# EAGLE design AOC v1 (EAGLE 7.7.0)
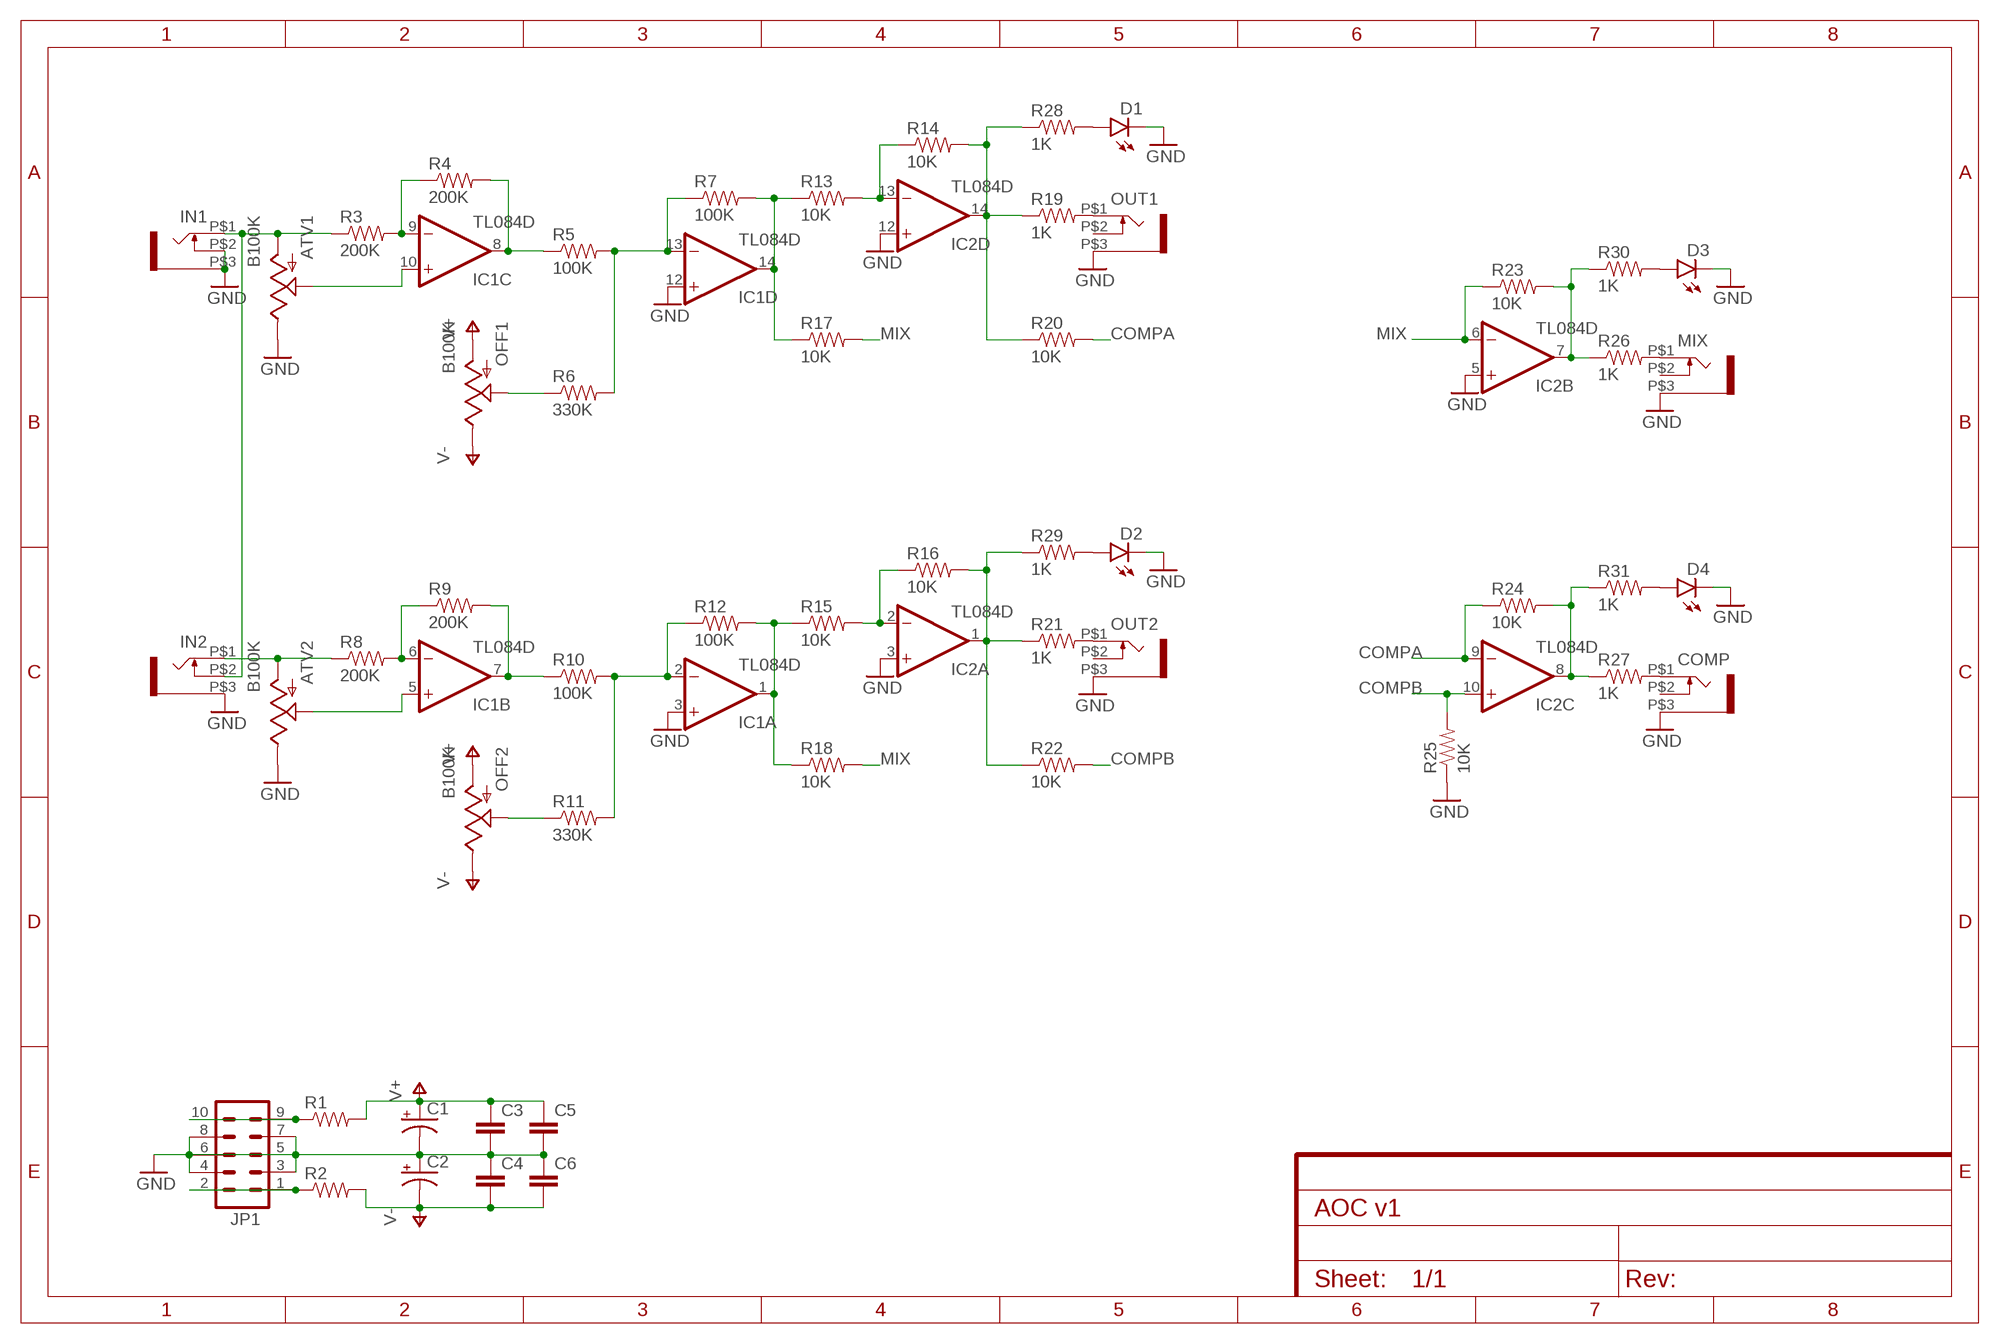
[diagram p0: schematic, sheet 1]

## Parts
ATV1  B100K  POT  [ALPS_POT]
ATV2  B100K  POT  [ALPS_POT]
C1  CAP_POLPTH2  [CPOL-RADIAL-10UF-25V]
C2  CAP_POLPTH2  [CPOL-RADIAL-10UF-25V]
C3  CAP0805  [0805]
C4  CAP0805  [0805]
C5  CAP0805  [0805]
C6  CAP0805  [0805]
COMP  WQP-PJ301M-12_JACK  [WQP-PJ301M-12_JACK]
D1  LED3MM  [LED3MM]
D2  LED3MM  [LED3MM]
D3  LED3MM  [LED3MM]
D4  LED3MM  [LED3MM]
IC1  TL084D  [SO14]
IC2  TL084D  [SO14]
IN1  WQP-PJ301M-12_JACK  [WQP-PJ301M-12_JACK]
IN2  WQP-PJ301M-12_JACK  [WQP-PJ301M-12_JACK]
JP1  M05X2PTH  [AVR_ICSP]
MIX  WQP-PJ301M-12_JACK  [WQP-PJ301M-12_JACK]
OFF1  B100K  POT  [ALPS_POT]
OFF2  B100K  POT  [ALPS_POT]
OUT1  WQP-PJ301M-12_JACK  [WQP-PJ301M-12_JACK]
OUT2  WQP-PJ301M-12_JACK  [WQP-PJ301M-12_JACK]
R1  RESISTOR0805-RES  [0805@1]
R2  RESISTOR0805-RES  [0805@1]
R3  200K  RESISTOR0805-RES  [0805@1]
R4  200K  RESISTOR0805-RES  [0805@1]
R5  100K  RESISTOR0805-RES  [0805@1]
R6  330K  RESISTOR0805-RES  [0805@1]
R7  100K  RESISTOR0805-RES  [0805@1]
R8  200K  RESISTOR0805-RES  [0805@1]
R9  200K  RESISTOR0805-RES  [0805@1]
R10  100K  RESISTOR0805-RES  [0805@1]
R11  330K  RESISTOR0805-RES  [0805@1]
R12  100K  RESISTOR0805-RES  [0805@1]
R13  10K  RESISTOR0805-RES  [0805@1]
R14  10K  RESISTOR0805-RES  [0805@1]
R15  10K  RESISTOR0805-RES  [0805@1]
R16  10K  RESISTOR0805-RES  [0805@1]
R17  10K  RESISTOR0805-RES  [0805@1]
R18  10K  RESISTOR0805-RES  [0805@1]
R19  1K  RESISTOR0805-RES  [0805@1]
R20  10K  RESISTOR0805-RES  [0805@1]
R21  1K  RESISTOR0805-RES  [0805@1]
R22  10K  RESISTOR0805-RES  [0805@1]
R23  10K  RESISTOR0805-RES  [0805@1]
R24  10K  RESISTOR0805-RES  [0805@1]
R25  10K  RESISTOR0805-RES  [0805@1]
R26  1K  RESISTOR0805-RES  [0805@1]
R27  1K  RESISTOR0805-RES  [0805@1]
R28  1K  RESISTOR0805-RES  [0805@1]
R29  1K  RESISTOR0805-RES  [0805@1]
R30  1K  RESISTOR0805-RES  [0805@1]
R31  1K  RESISTOR0805-RES  [0805@1]

## Nets
COMPA: IC2.9(C:-IN) R20.2 R24.1
COMPB: IC2.10(C:+IN) R22.2 R25.2
GND: ATV1.P$1(E) ATV2.P$1(E) C1.2(-) C2.1(+) C3.2 C4.1 C5.2 C6.1 COMP.P$3 D1.K(C) D2.K(C) D3.K(C) D4.K(C) IC1.3(A:+IN) IC1.12(D:+IN) IC2.3(A:+IN) IC2.5(B:+IN) IC2.12(D:+IN) IN1.P$2 IN1.P$3 IN2.P$3 JP1.3 JP1.4 JP1.5 JP1.6 JP1.7 JP1.8 MIX.P$3 OUT1.P$3 OUT2.P$3 R25.1
MIX: IC2.6(B:-IN) R17.2 R18.2 R23.1
N$1: JP1.9 JP1.10 R1.1
N$2: JP1.1 JP1.2 R2.1
N$3: IC1.9(C:-IN) R3.2 R4.1
N$4: ATV1.P$3(A) IN1.P$1 IN2.P$2 R3.1
N$5: IC1.8(C:OUT) R4.2 R5.1
N$6: ATV1.P$2(S) IC1.10(C:+IN)
N$7: OFF1.P$2(S) R6.1
N$8: IC1.13(D:-IN) R5.2 R6.2 R7.1
N$9: IC1.14(D:OUT) R7.2 R13.1 R17.1
N$10: IC1.6(B:-IN) R8.2 R9.1
N$11: ATV2.P$3(A) IN2.P$1 R8.1
N$12: IC1.7(B:OUT) R9.2 R10.1
N$13: ATV2.P$2(S) IC1.5(B:+IN)
N$14: OFF2.P$2(S) R11.1
N$15: IC1.2(A:-IN) R10.2 R11.2 R12.1
N$16: IC1.1(A:OUT) R12.2 R15.1 R18.1
N$17: IC2.13(D:-IN) R13.2 R14.1
N$18: IC2.14(D:OUT) R14.2 R19.1 R20.1 R28.1
N$19: IC2.2(A:-IN) R15.2 R16.1
N$20: IC2.1(A:OUT) R16.2 R21.1 R22.1 R29.1
N$21: MIX.P$1 R26.2
N$22: IC2.7(B:OUT) R23.2 R26.1 R30.1
N$23: OUT1.P$1 R19.2
N$24: OUT2.P$1 R21.2
N$25: IC2.8(C:OUT) R24.2 R27.1 R31.1
N$26: COMP.P$1 R27.2
N$27: D1.A R28.2
N$28: D2.A R29.2
N$29: D3.A R30.2
N$30: D4.A R31.2
V+: C1.1(+) C3.1 C5.1 OFF1.P$3(A) OFF2.P$3(A) R1.2
V-: C2.2(-) C4.2 C6.2 OFF1.P$1(E) OFF2.P$1(E) R2.2
Unconnected: COMP.P$2 MIX.P$2 OUT1.P$2 OUT2.P$2

## Power pins joined to a net without a drawn wire
V+: IC1.4(P:V+) IC2.4(P:V+)
V-: IC1.11(P:V-) IC2.11(P:V-)

## Library data of the parts
ATV1 ATV2 OFF1 OFF2 = SparkFun-Electromechanical:POT; PROD_ID: RES-09177
C1 C2 = SparkFun-Capacitors:CAP_POL: Capacitor Polarized These are standard SMD and PTH capacitors. Normally 10uF, 47uF, and 100uF in electrolytic and tantalum varieties. Always verify the external diameter of the through hole cap, it varies with capacity, voltage, and manufacturer. The EIA devices should be standard.
C3-C6 = SparkFun-Capacitors:CAP: Capacitor Standard 0603 ceramic capacitor, and 0.1" leaded capacitor.
COMP IN1 IN2 MIX OUT1 OUT2 = thonkiconn:WQP-PJ301M-12_JACK
D1-D4 = SparkFun-LED:LED: LEDs Standard schematic elements and footprints for 5mm, 3mm, 1206, and 0603 sized LEDs. 5mm - Spark Fun Electronics SKU : COM-00529 (and others)
IC1 IC2 = linear:TL084: OP AMP
JP1 = SparkFun-Connectors:M05X2: Header 5x2 Standard 10-pin dual row 0.1" header. Commonly used with AVR-ISP. Use with Spark Fun Electronics SKU: PRT-00778
R1-R31 = SparkFun-Passives:RESISTOR: Resistor Basic schematic elements and footprints for 0603, 1206, and PTH resistors.

## Board
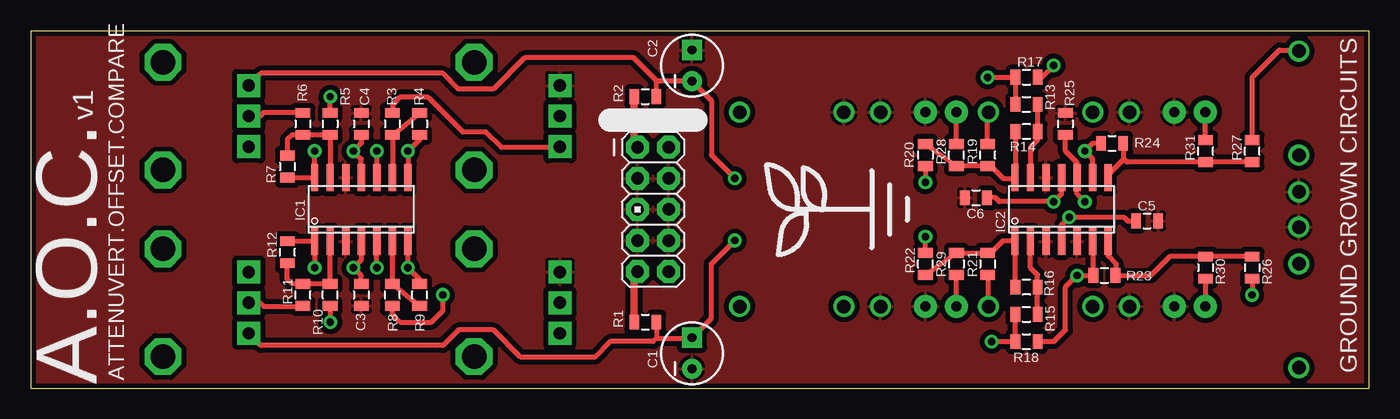
[diagram p1: board, top side]
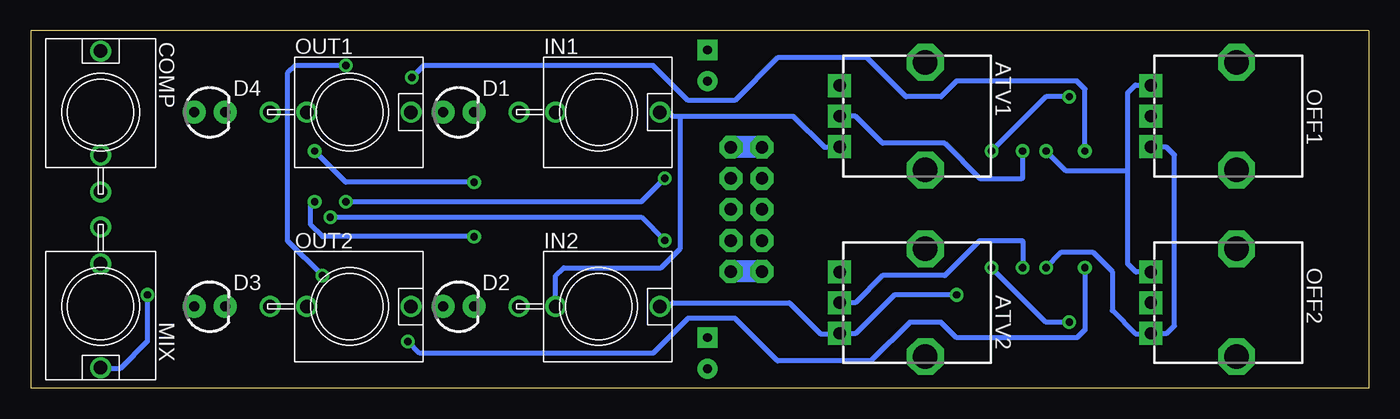
[diagram p2: board, bottom side, seen from below]

Size 109.22 x 29.21 mm. Coordinates in mm from the lower left corner, seen from the top.
Outline: 0,0 109.22,0 109.22,29.21 0,29.21 0,0
Copper layers (1*16): Top 0.035mm / dielectric 1.5mm / Bottom 0.035mm
Design rules "SparkFun": minimum track width 8mil, minimum drill 20mil, track to track 8mil, track to pad 8mil, pad to pad 8mil, via to via 8mil, smd to smd 8mil, copper to edge 8mil, drill to drill 8mil, minimum pad ring 12mil, minimum via ring 10mil, stop-mask expansion 4mil, vias tented up to drill 20mil, thermal gap 10mil

### Footprints (pad centres in the part's own frame; a part is rotated, then mirrored left to right if it is on the bottom)
ALPS_POT = drill 1 pad 1.88 square: P$1 7,-2.5; P$2 7,0; P$3 7,2.5 | drill 2 octagon: P$4 0,-4.4; P$5 0,4.4
CPOL-RADIAL-10UF-25V = drill 0.7 pad 1.651 square: 1 1.27,0 | drill 0.7 pad 1.651: 2 -1.27,0
0805 = smd 0.8 x 1.2: 1 -0.9,0; 2 0.9,0
WQP-PJ301M-12_JACK = drill 1.1: P$1 0,5; P$2 0,-3.5; P$3 0,-6.5
LED3MM = drill 0.813 pad 1.88: A -1.27,0; K 1.27,0
SO14 = smd 0.6 x 2.2: 1 -3.81,-2.6; 2 -2.54,-2.6; 3 -1.27,-2.6; 4 0,-2.6; 5 1.27,-2.6; 6 2.54,-2.6; 7 3.81,-2.6; 8 3.81,2.6; 9 2.54,2.6; 10 1.27,2.6; 11 0,2.6; 12 -1.27,2.6; 13 -2.54,2.6; 14 -3.81,2.6
AVR_ICSP = drill 1.016 pad 1.88 octagon: 1 -1.27,5.08; 2 1.27,5.08; 3 -1.27,2.54; 4 1.27,2.54; 5 -1.27,0; 6 1.27,0; 7 -1.27,-2.54; 8 1.27,-2.54; 9 -1.27,-5.08; 10 1.27,-5.08
0805@1 = smd 0.8 x 1.2: 1 -0.9,0; 2 0.9,0

### Placement (x,y rotation side)
ATV1  36.2,22.23 180 bottom
ATV2  36.2,6.99 180 bottom
C1  53.98,2.86 90 top
C2  53.98,26.35 90 top
C3  26.99,7.62 270 top
C4  26.99,21.59 270 top
C5  91.12,13.65 0 top
C6  77.15,15.56 0 top
COMP  103.5,22.54 0 bottom
D1  74.3,22.54 0 bottom
D2  74.3,6.67 0 bottom
D3  94.61,6.67 0 bottom
D4  94.61,22.54 0 bottom
IC1  26.99,14.61 0 top
IC2  84.14,14.61 0 top
IN1  62.87,22.54 270 bottom
IN2  62.87,6.67 270 bottom
JP1  50.8,14.61 0 top
MIX  103.5,6.67 180 bottom
OFF1  10.79,22.23 180 bottom
OFF2  10.79,6.99 180 bottom
OUT1  83.19,22.54 270 bottom
OUT2  83.19,6.67 270 bottom
R1  50.16,5.4 0 top
R2  50.16,23.81 0 top
R3  29.53,21.59 270 top
R4  31.75,21.59 270 top
R5  24.45,21.59 270 top
R6  22.23,21.59 270 top
R7  20.95,18.1 270 top
R8  29.53,7.62 90 top
R9  31.75,7.62 90 top
R10  24.45,7.62 90 top
R11  22.23,7.62 90 top
R12  20.95,11.11 90 top
R13  81.28,23.18 0 top
R14  81.28,20.95 180 top
R15  81.28,6.03 0 top
R16  81.28,8.26 180 top
R17  81.28,25.4 0 top
R18  81.28,3.81 0 top
R19  78.11,19.05 90 top
R20  73.03,19.05 270 top
R21  78.11,10.16 270 top
R22  73.03,10.16 90 top
R23  87.63,9.21 0 top
R24  88.27,20 0 top
R25  84.45,21.59 270 top
R26  99.69,9.84 270 top
R27  99.69,19.37 90 top
R28  75.56,19.05 90 top
R29  75.56,10.16 270 top
R30  95.89,9.84 270 top
R31  95.89,19.37 90 top
U$1  [LOGO_MED]  68.58,14.61 90 top

### Tracks (layer width: path | path; a pad name or v marks a point on that pad's centre or on a via)
COMPA  (via drill 0.6)
  Top 0.406: R20.2 v73.03,16.83 | R24.1 86.68,20 v86.04,19.37 86.68,18.73 IC2.9
  Bottom 0.406: v73.03,16.83 83.5,16.83 v86.04,19.37
COMPB  (via drill 0.6)
  Top 0.406: R22.2 v73.03,12.38 | v86.04,15.24 85.41,15.88 IC2.10 85.41,18.41 84.45,19.37 R25.2
  Bottom 0.406: v73.03,12.38 85.41,12.38 86.36,13.34 86.36,14.92 v86.04,15.24
GND
  pour Top (isolate 0.406): 0,0 109.22,0 109.22,29.21 0,29.21
MIX  (via drill 0.6)
  Top 0.406: R17.2 82.55,25.4 v83.5,26.35 | R18.2 83.5,3.81 84.45,4.76 84.45,8.26 v85.41,9.21 R23.1 86.68,9.26 IC2.6
  Bottom 0.406: v83.5,26.35 87.63,26.35 88.27,25.72 88.27,12.06 v85.41,9.21
N$1
  Top 0.61: R1.1 49.27,9.26 JP1.9
  Bottom 1.778: JP1.9 JP1.10
N$2
  Top 0.61: R2.1 49.27,19.95 JP1.1
  Bottom 1.778: JP1.1 JP1.2
N$3
  Top 0.406: R4.1 R3.2 IC1.9
N$4
  Top 0.406: R3.1 29.53,23.18 30.16,23.81 32.38,23.81 35.24,20.95 37.15,20.95 38.42,19.68 43.16,19.68 ATV1.P$3
  Bottom 0.406: IN1.P$1 57.15,22.54 56.83,22.23 56.2,22.23 | 56.2,22.23 46.99,22.23 44.45,19.68 43.23,19.68 ATV1.P$3 | IN2.P$2 66.36,9.2 65.72,9.84 57.78,9.84 56.2,11.43 56.2,22.23
N$5  (via drill 0.6)
  Top 0.406: R5.1 v24.45,23.81 | IC1.8 v30.8,19.37 31.75,20.32 R4.2
  Bottom 0.406: v24.45,23.81 26.35,23.81 v30.8,19.37
N$6  (via drill 0.6)
  Top 0.406: v28.26,19.37 IC1.10
  Bottom 0.406: v28.26,19.37 IC1.10 28.32,17.14 31.75,17.14 34.61,20 39.69,20 41.91,22.23 ATV1.P$2
N$7
  Top 0.406: OFF1.P$2 18.73,22.23 19.05,22.54 22.17,22.54 R6.1
N$8
  Top 0.406: R7.1 20.95,20.32 21.32,20.69 R6.2 R5.2 IC1.13
N$9  (via drill 0.6)
  Top 0.406: R7.2 23.17,17.2 IC1.14 v23.18,19.37 | v78.11,25.4 R17.1 R13.1
  Bottom 0.406: v23.18,19.37 23.18,24.45 23.81,25.08 33.66,25.08 34.92,23.81 37.78,23.81 40.96,26.99 48.26,26.99 51.75,23.5 55.56,23.5 58.42,26.35 77.15,26.35 v78.11,25.4
N$10
  Top 0.406: R9.1 R8.2 IC1.6
N$11  (via drill 0.6)
  Top 0.406: R8.1 29.53,6.03 30.16,5.4 32.7,5.4 33.66,6.35 v33.66,7.62
  Bottom 0.406: v33.66,7.62 38.73,7.62 41.91,4.45 43.16,4.45 ATV2.P$3 43.23,4.45 44.77,4.45 47.31,6.99 56.83,6.99 57.15,6.67 IN2.P$1
N$12  (via drill 0.6)
  Top 0.406: R10.1 v24.45,5.4 | IC1.7 v30.8,9.84 31.75,8.89 R9.2
  Bottom 0.406: v24.45,5.4 26.35,5.4 v30.8,9.84
N$13  (via drill 0.6)
  Top 0.406: v28.26,9.84 IC1.5
  Bottom 0.406: v28.26,9.84 IC1.5 28.32,12.06 31.75,12.06 34.61,9.21 39.69,9.21 41.91,6.99 ATV2.P$2
N$14
  Top 0.406: OFF2.P$2 18.73,6.99 19.05,6.67 22.17,6.67 R11.1
N$15
  Top 0.406: R12.1 20.95,8.89 21.32,8.52 R11.2 R10.2 IC1.2
N$16  (via drill 0.6)
  Top 0.406: R12.2 IC1.1 v23.18,9.84 | v78.42,3.81 R18.1 R15.1
  Bottom 0.406: v23.18,9.84 23.18,4.76 23.81,4.13 33.66,4.13 34.92,5.4 37.47,5.4 40.64,2.22 48.26,2.22 51.75,5.71 55.56,5.71 58.42,2.86 77.47,2.86 v78.42,3.81
N$17
  Top 0.406: R13.2 R14.1 82.18,20.27 81.6,19.68 IC2.13
N$18
  Top 0.406: R20.1 R28.1 R19.1 78.37,18.15 79.38,17.14 80.27,17.14 IC2.14 80.38,17.26 R14.2
N$19
  Top 0.406: R15.2 R16.1 82.18,9.26 81.6,9.84 IC2.2
N$20
  Top 0.406: R22.1 R29.1 R21.1 78.37,11.06 79.38,12.06 80.27,12.06 IC2.1 80.38,11.95 R16.2
N$21  (via drill 0.6)
  Top 0.406: R26.2 v99.69,7.62
  Bottom 0.406: v99.69,7.62 99.69,3.81 101.92,1.59 103.42,1.59 MIX.P$1
N$22
  Top 0.406: R26.1 R30.1 95.83,10.79 93.03,10.79 91.44,9.21 R23.2 88.58,9.26 88.58,10.16 87.95,10.79 IC2.7
N$23
  Top 0.406: R19.2 78.11,22.46 OUT1.P$1
N$24
  Top 0.406: OUT2.P$1 78.19,9.18 R21.2
N$25
  Top 0.406: R27.1 R31.1 89.48,18.47 89.22,18.73 | IC2.8 87.95,17.46 89.22,18.73 | 89.22,18.73 89.22,19.95 R24.2
N$26
  Top 0.406: R27.2 99.69,25.4 101.92,27.62 103.42,27.62 COMP.P$1
N$27
  Top 0.406: R28.2 D1.A
N$28
  Top 0.406: D2.A R29.2
N$29
  Top 0.406: R30.2 D3.A
N$30
  Top 0.406: R31.2 D4.A
V+  (via drill 0.6)
  Top 0.406: R1.2 51.06,4.08 | 51.06,4.08 53.92,4.08 C1.1 55.56,5.71 55.56,10.16 v57.47,12.06 | 51.06,4.08 50.8,3.81 47.31,3.81 46.04,2.54 40.01,2.54 37.78,4.76 34.92,4.76 33.66,3.49 18.79,3.49 OFF2.P$3 | IC1.4 26.99,10.48 v26.35,9.84 26.99,9.21 C3.1 | IC2.4 84.14,13.34 v84.77,13.97 89.22,13.97 89.53,13.65 C5.1
  Bottom 0.406: OFF1.P$3 17.75,19.68 16.51,19.68 15.88,19.05 15.88,5.08 16.47,4.49 OFF2.P$3 17.84,4.45 19.05,4.45 20.95,6.35 20.95,9.53 22.54,11.11 25.08,11.11 v26.35,9.84 | v84.77,13.97 59.37,13.97 v57.47,12.06
V-  (via drill 0.6)
  Top 0.406: R2.2 51.06,25.14 | 51.06,25.14 51.12,25.08 C2.2 55.56,23.5 55.56,19.05 v57.47,17.14 | 51.06,25.14 49.21,26.99 40.32,26.99 37.78,24.45 34.92,24.45 33.66,25.72 18.79,25.72 OFF1.P$1 | IC1.11 26.99,18.73 v26.35,19.37 26.99,20 C4.2 | IC2.11 84.14,15.88 v83.5,15.24 79.06,15.24 78.74,15.56 C6.2
  Bottom 0.406: OFF2.P$1 19.01,9.48 19.68,10.16 19.68,17.78 | 19.68,17.78 19.68,24.13 19.05,24.77 17.84,24.77 OFF1.P$1 | v26.35,19.37 24.77,17.78 19.68,17.78 | v83.5,15.24 59.37,15.24 v57.47,17.14

### Text on the board
tPlace: v1 | ATTENUVERT.OFFSET.COMPARE | GROUND GROWN CIRCUITS | A.O.C.